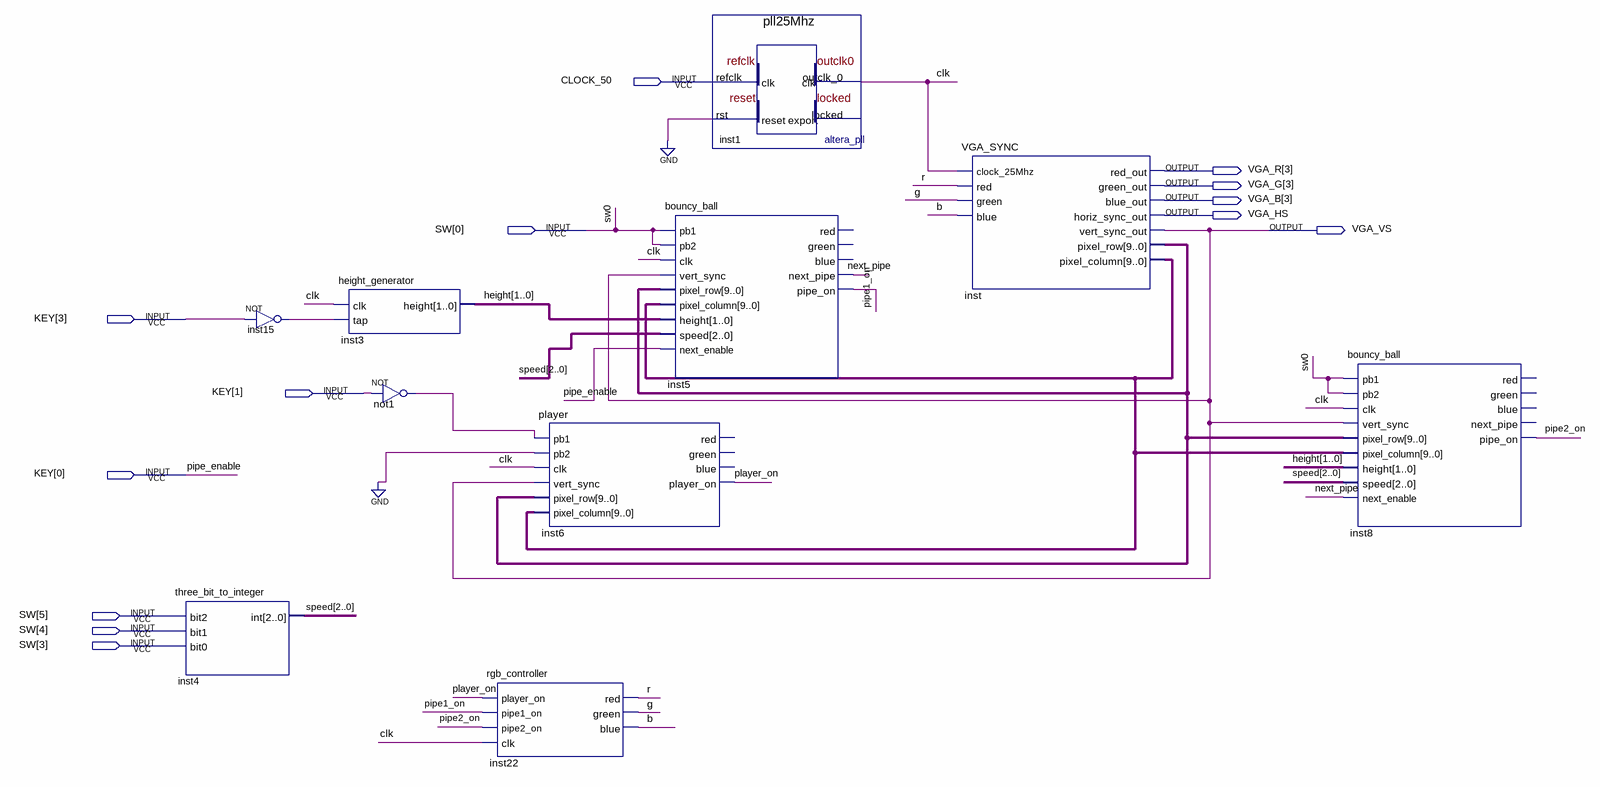
[diagram p0: schematic sheet]
// Quartus schematic pipe_tester.bdf as structural Verilog: 10 symbols, 13 pins
module pipe_tester (
  input  CLOCK_50,
  input  [5:0] SW,
  input  [3:0] KEY,
  output [3:3] VGA_R,
  output [3:3] VGA_G,
  output [3:3] VGA_B,
  output VGA_HS,
  output VGA_VS
);

  wire b, clk, g, inst15_out, next_pipe, not1_out, pipe1_on, pipe2_on, player_on, r;
  wire [1:0] height;
  wire [2:0] speed;
  wire [9:0] inst_pixel_column, inst_pixel_row;

  three_bit_to_integer inst4 (.bit2(SW[5]), .bit1(SW[4]), .bit0(SW[3]), .\int (speed));
  not inst15 (inst15_out, KEY[3]);
  height_generator inst3 (.clk(clk), .tap(inst15_out), .height(height));
  not not1 (not1_out, KEY[1]);
  rgb_controller inst22 (
    .player_on(player_on), .pipe1_on(pipe1_on), .pipe2_on(pipe2_on), .clk(clk), .red(r), .green(g), .blue(b));
  player inst6 (
    .pb1(not1_out), .pb2(1'b0), .clk(clk), .vert_sync(VGA_VS), .pixel_row(inst_pixel_row),
    .pixel_column(inst_pixel_column), .player_on(player_on));  // open: red, green, blue
  bouncy_ball inst5 (
    .pb1(SW[0]), .pb2(SW[0]), .clk(clk), .vert_sync(VGA_VS), .pixel_row(inst_pixel_row),
    .pixel_column(inst_pixel_column), .height(height), .speed(speed), .next_enable(KEY[0]),
    .next_pipe(next_pipe), .pipe_on(pipe1_on));  // open: red, green, blue
  pll25Mhz inst1 (.refclk(CLOCK_50), .rst(1'b0), .outclk_0(clk));  // open: locked
  VGA_SYNC inst (
    .clock_25Mhz(clk), .red(r), .green(g), .blue(b), .red_out(VGA_R[3]), .green_out(VGA_G[3]),
    .blue_out(VGA_B[3]), .horiz_sync_out(VGA_HS), .vert_sync_out(VGA_VS), .pixel_row(inst_pixel_row),
    .pixel_column(inst_pixel_column));
  bouncy_ball inst8 (
    .pb1(SW[0]), .pb2(SW[0]), .clk(clk), .vert_sync(VGA_VS), .pixel_row(inst_pixel_row),
    .pixel_column(inst_pixel_column), .height(height), .speed(speed), .next_enable(next_pipe),
    .pipe_on(pipe2_on));  // open: red, green, blue, next_pipe

  // Other names for the same wires on the sheet: pipe_enable = KEY[0]
endmodule
